# Altium schematic sheet MCB_TOP.SchDoc
size A4
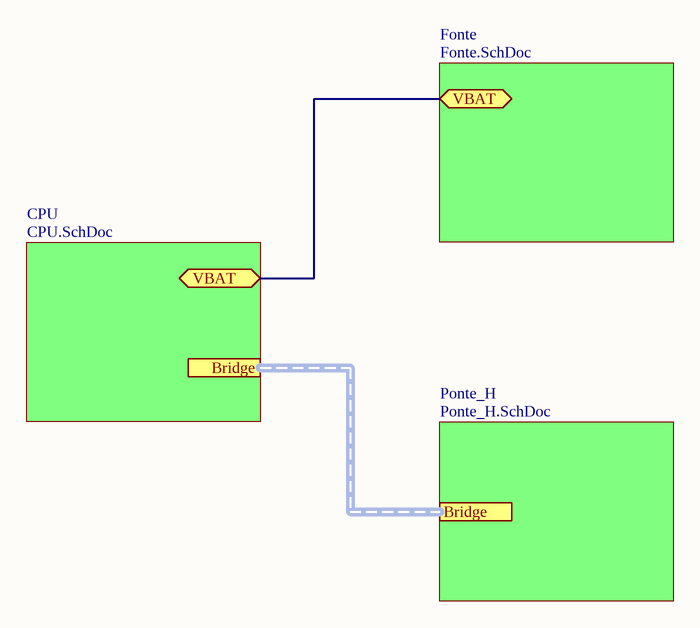
[diagram p0: MCB_TOP.SchDoc]

## Sub-sheets
CPU = CPU.SchDoc: no entries
Fonte = Fonte.SchDoc: no entries
Ponte_H = Ponte_H.SchDoc: no entries

## Ports
Bridge (harness Bridge), VBAT (bidir)